# Altium schematic sheet Block_Diagram.SchDoc
size A3; Date: 24.01.2025; DocumentNumber: 2; Revision: a; SheetNumber: 2; SheetTotal: 5; project name: wirelless security dedector; ENG_APP_DATE: --/--/--; DSN_APP_DATE: --/--/--; CHK_APP_DATE: --/--/--
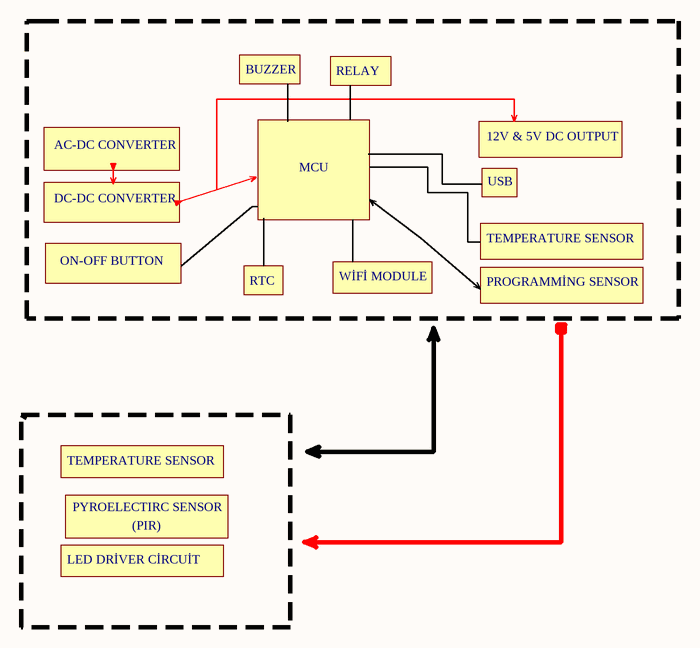
[diagram p0: Block_Diagram.SchDoc]

## Notes on the sheet
- BUZZER
- RELAY
- AC-DC CONVERTER
- MCU
- 12V & 5V DC OUTPUT
- USB
- DC-DC CONVERTER
- ON-OFF BUTTON
- TEMPERATURE SENSOR
- RTC
- WİFİ MODULE
- PROGRAMMİNG SENSOR
- PYROELECTIRC SENSOR
- (PIR)
- LED DRİVER CİRCUİT
- DWG. NO.
- REV.
- SHT.
- REVISION
- DESCRIPTION
- DATE
- APPROVED
- THIS DOCUMENT AND THE DATA DISCLOSED HEREIN OR HEREWITH IS THE PROPERTY OF ALTIUM LIMITED AND MAY BE FREELY DISTRIBUTED IN WHOLE. NO RIGHTS ARE RESERVED OR EXPRESS OR IMPLIED WARANTEE GIVEN.
- ENG:
- DSN:
- APPROVALS
- PROJECT
- DOCUMENT REVISION:
- DESIGN ITEM:
- CHK:
- BOM:
- REFERENCE DOCUMENTS
- PROJECT REVISION:
- TITLE
- FAB DWG:
- PCB DWG:
- ASSY DWG:
- SCALE:
- SIZE
- C
- CAGE CODE
- FILE NAME
- DWG NO.
- SHEET
- OF
- REV